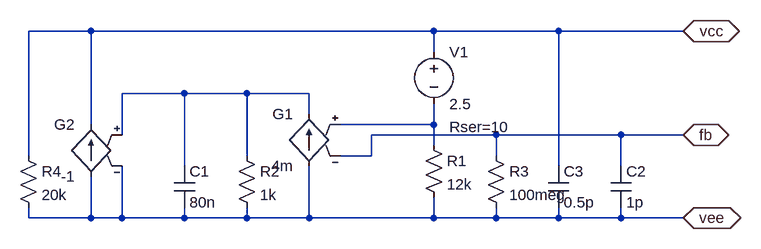
[diagram p0: schematic LM136.asc]
LM136.asc, the LTspice schematic file:
Version 4
SHEET 1 880 680
WIRE -560 128 -656 128
WIRE -32 128 -560 128
WIRE 160 128 -32 128
WIRE 352 128 160 128
WIRE -32 160 -32 128
WIRE -416 224 -512 224
WIRE -320 224 -416 224
WIRE -224 224 -320 224
WIRE -224 256 -224 224
WIRE -560 272 -560 128
WIRE -32 272 -32 240
WIRE -32 272 -176 272
WIRE -512 288 -512 224
WIRE 64 288 -128 288
WIRE 256 288 64 288
WIRE 352 288 256 288
WIRE -32 304 -32 272
WIRE -656 320 -656 128
WIRE -320 320 -320 224
WIRE -128 320 -128 288
WIRE -128 320 -176 320
WIRE 64 320 64 288
WIRE -416 336 -416 224
WIRE 160 336 160 128
WIRE 256 336 256 288
WIRE -656 416 -656 400
WIRE -560 416 -560 352
WIRE -560 416 -656 416
WIRE -512 416 -512 336
WIRE -512 416 -560 416
WIRE -416 416 -416 400
WIRE -416 416 -512 416
WIRE -320 416 -320 400
WIRE -320 416 -416 416
WIRE -224 416 -224 336
WIRE -224 416 -320 416
WIRE -32 416 -32 384
WIRE -32 416 -224 416
WIRE 64 416 64 400
WIRE 64 416 -32 416
WIRE 160 416 160 400
WIRE 160 416 64 416
WIRE 256 416 256 400
WIRE 256 416 160 416
WIRE 352 416 256 416
FLAG 352 128 vcc
IOPIN 352 128 BiDir
FLAG 352 416 vee
IOPIN 352 416 BiDir
FLAG 352 288 fb
IOPIN 352 288 BiDir
SYMBOL voltage -32 144 R0
WINDOW 123 0 0 Left 0
WINDOW 39 24 132 Left 0
SYMATTR SpiceLine Rser=10
SYMATTR InstName V1
SYMATTR Value 2.5
SYMBOL res -48 288 R0
SYMATTR InstName R1
SYMATTR Value 12k
SYMBOL g -224 240 M0
SYMATTR InstName G1
SYMATTR Value 4m
SYMBOL res -336 304 R0
SYMATTR InstName R2
SYMATTR Value 1k
SYMBOL cap -432 336 R0
SYMATTR InstName C1
SYMATTR Value 80n
SYMBOL g -560 256 M0
SYMATTR InstName G2
SYMATTR Value -1
SYMBOL res 48 304 R0
SYMATTR InstName R3
SYMATTR Value 100meg
SYMBOL cap 240 336 R0
SYMATTR InstName C2
SYMATTR Value 1p
SYMBOL cap 144 336 R0
SYMATTR InstName C3
SYMATTR Value 0.5p
SYMBOL res -672 304 R0
SYMATTR InstName R4
SYMATTR Value 20k

The netlist it stands for:
* LM136.asc
V1 vcc N002 2.5 Rser=10
R1 N002 vee 12k
G1 vee N001 N002 fb 4m
R2 N001 vee 1k
C1 N001 vee 80n
G2 vee vcc N001 vee -1
R3 fb vee 100meg
C2 fb vee 1p
C3 vcc vee 0.5p
R4 vcc vee 20k
.backanno
.end